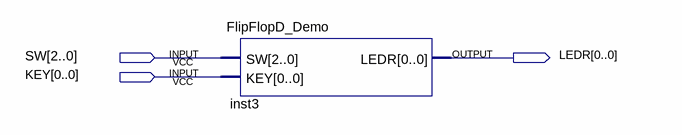
[diagram p0: schematic sheet]
// Quartus schematic FlipFlop_Demo.bdf as structural Verilog: 1 symbols, 3 pins
module FlipFlop_Demo (
  input  [2:0] SW,
  input  [0:0] KEY,
  output [0:0] LEDR
);

  FlipFlopD_Demo inst3 (.SW(SW), .KEY(KEY[0]), .LEDR(LEDR[0]));
endmodule
